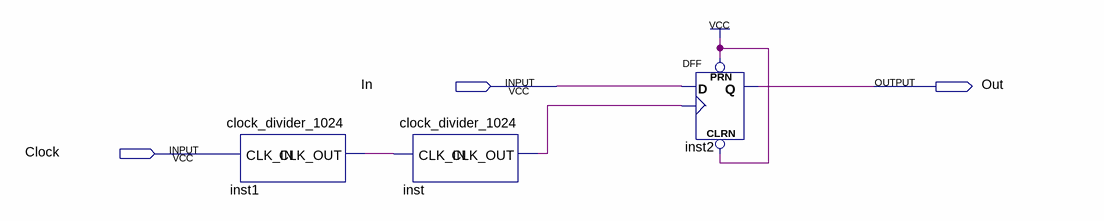
[diagram p0: schematic sheet]
// Quartus schematic Debouncer.bdf as structural Verilog: 3 symbols, 3 pins
module Debouncer (
  input  In,
  input  Clock,
  output Out
);

  wire inst1_clk_out, inst_clk_out;

  clock_divider_1024 inst1 (.CLK_IN(Clock), .CLK_OUT(inst1_clk_out));
  clock_divider_1024 inst (.CLK_IN(inst1_clk_out), .CLK_OUT(inst_clk_out));
  DFF inst2 (.CLRN(1'b1), .CLK(inst_clk_out), .D(In), .PRN(1'b1), .Q(Out));
endmodule
